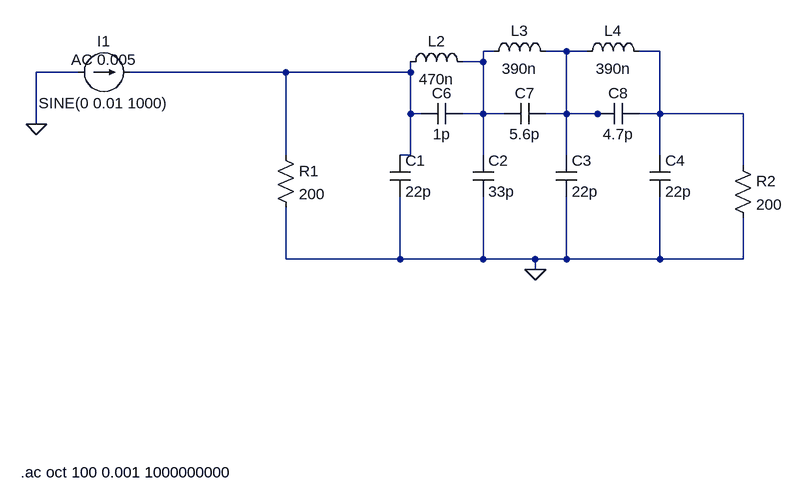
[diagram p0: schematic Output Filter.asc]
Output Filter.asc, the LTspice schematic file:
Version 4
SHEET 1 880 680
WIRE 32 -144 16 -144
WIRE 144 -144 112 -144
WIRE 176 -144 144 -144
WIRE 288 -144 256 -144
WIRE 16 -128 16 -144
WIRE 16 -128 -16 -128
WIRE -608 -112 -672 -112
WIRE -288 -112 -528 -112
WIRE -96 -112 -96 -128
WIRE -96 -112 -288 -112
WIRE -96 -48 -96 -112
WIRE -80 -48 -96 -48
WIRE 16 -48 16 -128
WIRE 16 -48 -16 -48
WIRE 48 -48 16 -48
WIRE 144 -48 144 -144
WIRE 144 -48 112 -48
WIRE 192 -48 144 -48
WIRE 208 -48 192 -48
WIRE 288 -48 288 -144
WIRE 288 -48 256 -48
WIRE 416 -48 288 -48
WIRE -672 -32 -672 -112
WIRE -288 16 -288 -112
WIRE -96 16 -96 -48
WIRE -96 16 -112 16
WIRE 16 16 16 -48
WIRE 144 16 144 -48
WIRE 288 16 288 -48
WIRE 416 32 416 -48
WIRE -288 176 -288 96
WIRE -112 176 -112 80
WIRE -112 176 -288 176
WIRE 16 176 16 80
WIRE 16 176 -112 176
WIRE 96 176 16 176
WIRE 144 176 144 80
WIRE 144 176 96 176
WIRE 288 176 288 80
WIRE 288 176 144 176
WIRE 416 176 416 112
WIRE 416 176 288 176
WIRE 96 192 96 176
FLAG -672 -32 0
FLAG 96 192 0
SYMBOL current -608 -112 R270
WINDOW 0 32 40 VTop 2
WINDOW 3 -32 40 VBottom 2
WINDOW 39 0 0 Left 2
WINDOW 123 4 40 VTop 2
SYMATTR InstName I1
SYMATTR Value SINE(0 0.01 1000)
SYMATTR Value2 AC 0.005
SYMBOL res -304 0 R0
SYMATTR InstName R1
SYMATTR Value 200
SYMBOL res 400 16 R0
SYMATTR InstName R2
SYMATTR Value 200
SYMBOL cap -128 16 R0
SYMATTR InstName C1
SYMATTR Value 22p
SYMBOL cap 0 16 R0
SYMATTR InstName C2
SYMATTR Value 33p
SYMBOL cap 128 16 R0
SYMATTR InstName C3
SYMATTR Value 22p
SYMBOL cap 272 16 R0
SYMATTR InstName C4
SYMATTR Value 22p
SYMBOL cap -16 -64 R90
WINDOW 0 0 32 VBottom 2
WINDOW 3 32 32 VTop 2
SYMATTR InstName C6
SYMATTR Value 1p
SYMBOL cap 112 -64 R90
WINDOW 0 0 32 VBottom 2
WINDOW 3 32 32 VTop 2
SYMATTR InstName C7
SYMATTR Value 5.6p
SYMBOL cap 256 -64 R90
WINDOW 0 0 32 VBottom 2
WINDOW 3 32 32 VTop 2
SYMATTR InstName C8
SYMATTR Value 4.7p
SYMBOL ind -112 -112 R270
WINDOW 0 32 56 VTop 2
WINDOW 3 5 56 VBottom 2
SYMATTR InstName L2
SYMATTR Value 470n
SYMBOL ind 16 -128 R270
WINDOW 0 32 56 VTop 2
WINDOW 3 5 56 VBottom 2
SYMATTR InstName L3
SYMATTR Value 390n
SYMBOL ind 160 -128 R270
WINDOW 0 32 56 VTop 2
WINDOW 3 5 56 VBottom 2
SYMATTR InstName L4
SYMATTR Value 390n
TEXT -696 504 Left 2 !.ac oct 100 0.001 1000000000

The netlist it stands for:
* Output Filter.asc
I1 0 N004 SINE(0 0.01 1000) AC 0.005
R1 N004 0 200
R2 N003 0 200
C1 N004 0 22p
C2 N001 0 33p
C3 N002 0 22p
C4 N003 0 22p
C6 N001 N004 1p
C7 N002 N001 5.6p
C8 N003 N002 4.7p
L2 N004 N001 470n
L3 N001 N002 390n
L4 N002 N003 390n
.ac oct 100 0.001 1000000000
.backanno
.end